# Altium schematic sheet [2]Power.SchDoc
size A
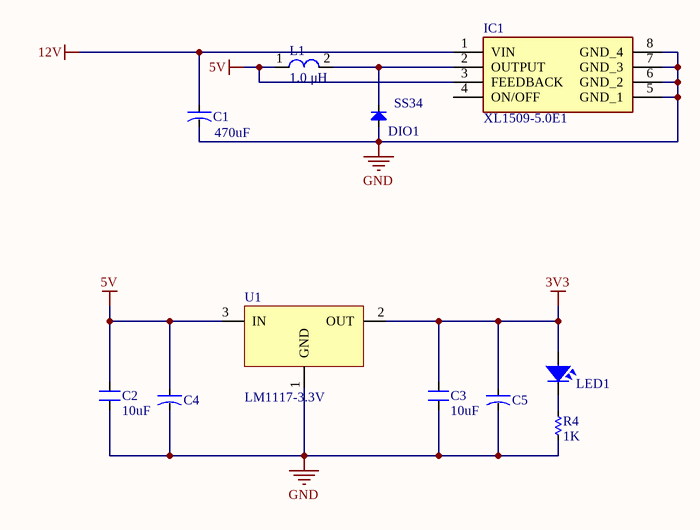
[diagram p0: [2]Power.SchDoc]

## Parts
C1  470uF  [CAP-ALU-SMD-6.3x7.7x2.2]
C2  10uF  [CN-SMD-0603]
C3  10uF  [CN-SMD-0603]
C4  CN-ALU-SMD  [CAP-ALU-SMD-4.5x5x1.4]  (value not drawn)
C5  CN-ALU-SMD  [CAP-ALU-SMD-4.5x5x1.4]  (value not drawn)
DIO1  SS34  [DIO-SMD-106]
IC1  XL1509-5.0E1  [SOIC127P600X175-8N]
L1  1.0 μH  [L-SMD-M-7.3x4.5]
LED1  LED  [LED-0805-Blue]  (value not drawn)
R4  1K  [RES-SMD-0603]
U1  LM1117-3.3V  [SOT223]

## Nets
3V3: C3.1 C5.1 LED1.1 U1.2(OUT)
5V: C2.1 C4.1 IC1.3(FEEDBACK) L1.1 U1.3(IN)
12V: C1.1 IC1.1(VIN)
GND: C1.2 C2.2 C3.2 C4.2 C5.2 DIO1.1(A) IC1.5(GND_1) IC1.6(GND_2) IC1.7(GND_3) IC1.8(GND_4) R4.2 U1.1(GND)
NetDIO1_2: DIO1.2(K) IC1.2(OUTPUT) L1.2
NetLED1_2: LED1.2 R4.1

Not connected (* = marked no-connect by the designer): IC1 4(ON/OFF)

## Library data of the parts
C1 C4 C5 = CN-ALU-SMD: Polarized Capacitor (Axial); Published: 8-Jun-2000; LatestRevisionDate: 17-Jul-2002; LatestRevisionNote: Re-released for DXP Platform.; PackageReference: POLAR0.8; Publisher: Altium Limited
C2 C3 = CN: Tu gom; Value: 33pF
DIO1 = Diode SMD: Default Diode; Code - JEDEC: DO-214-AB; Value: 1N5007; Published: 8-Jun-2000; Revision: July-2002: Re-released for DXP Platform.; Publisher: Altium Limited
IC1 = XL1509-5.0E1: Integrated Circuit; Manufacturer_Name: XLSEMI; Datasheet Link: https://datasheet.lcsc.com/szlcsc/XLSEMI-XL1509-5-0E1_C61063.pdf; Height: 1.75mm; Manufacturer_Part_Number: XL1509-5.0E1
L1 = L-SMD-1: partNo: 78477010; Manufacturer: Wurth Elektronik; Inductance: 1.0 μH; ComponentLink1Description: Manufacturer; ComponentLink1URL: http://www.we-online.de; Created by: Baojun Chen; Created Date: Nov.2015; ComponentLink2Description: Datasheet; ComponentLink2URL: http://katalog.we-online.de/pbs/datasheet/78477010.pdf
LED1 = LED SMD: Value: LED 3 - 5 ly 2 Colour
R4 = Res-SMD: Resistor; Manufacturer: Generic Components; Class: Passive; Published: 08/06/2000; Publisher: Altium Hobart Technology Centre
U1 = LM1117: 800mA Low-Dropout Linear Regulator; Creator: Nguyen Ba Bien; Website: http://group3i.net